# Altium schematic sheet power-v29.SchDoc: Power 29V
size Letter; CheckedBy: J. Brinton; CompanyName: Signal Laboratories, Inc.; DrawnBy: J. Brinton; Engineer: J. Brinton; Address1: 3479 Edison Way; Address2: Menlo Park CA 94025; Address3: +1 (877) 778-8435; Address4: siglabs.com; Revision: 3; SheetNumber: 41; SheetTotal: 53
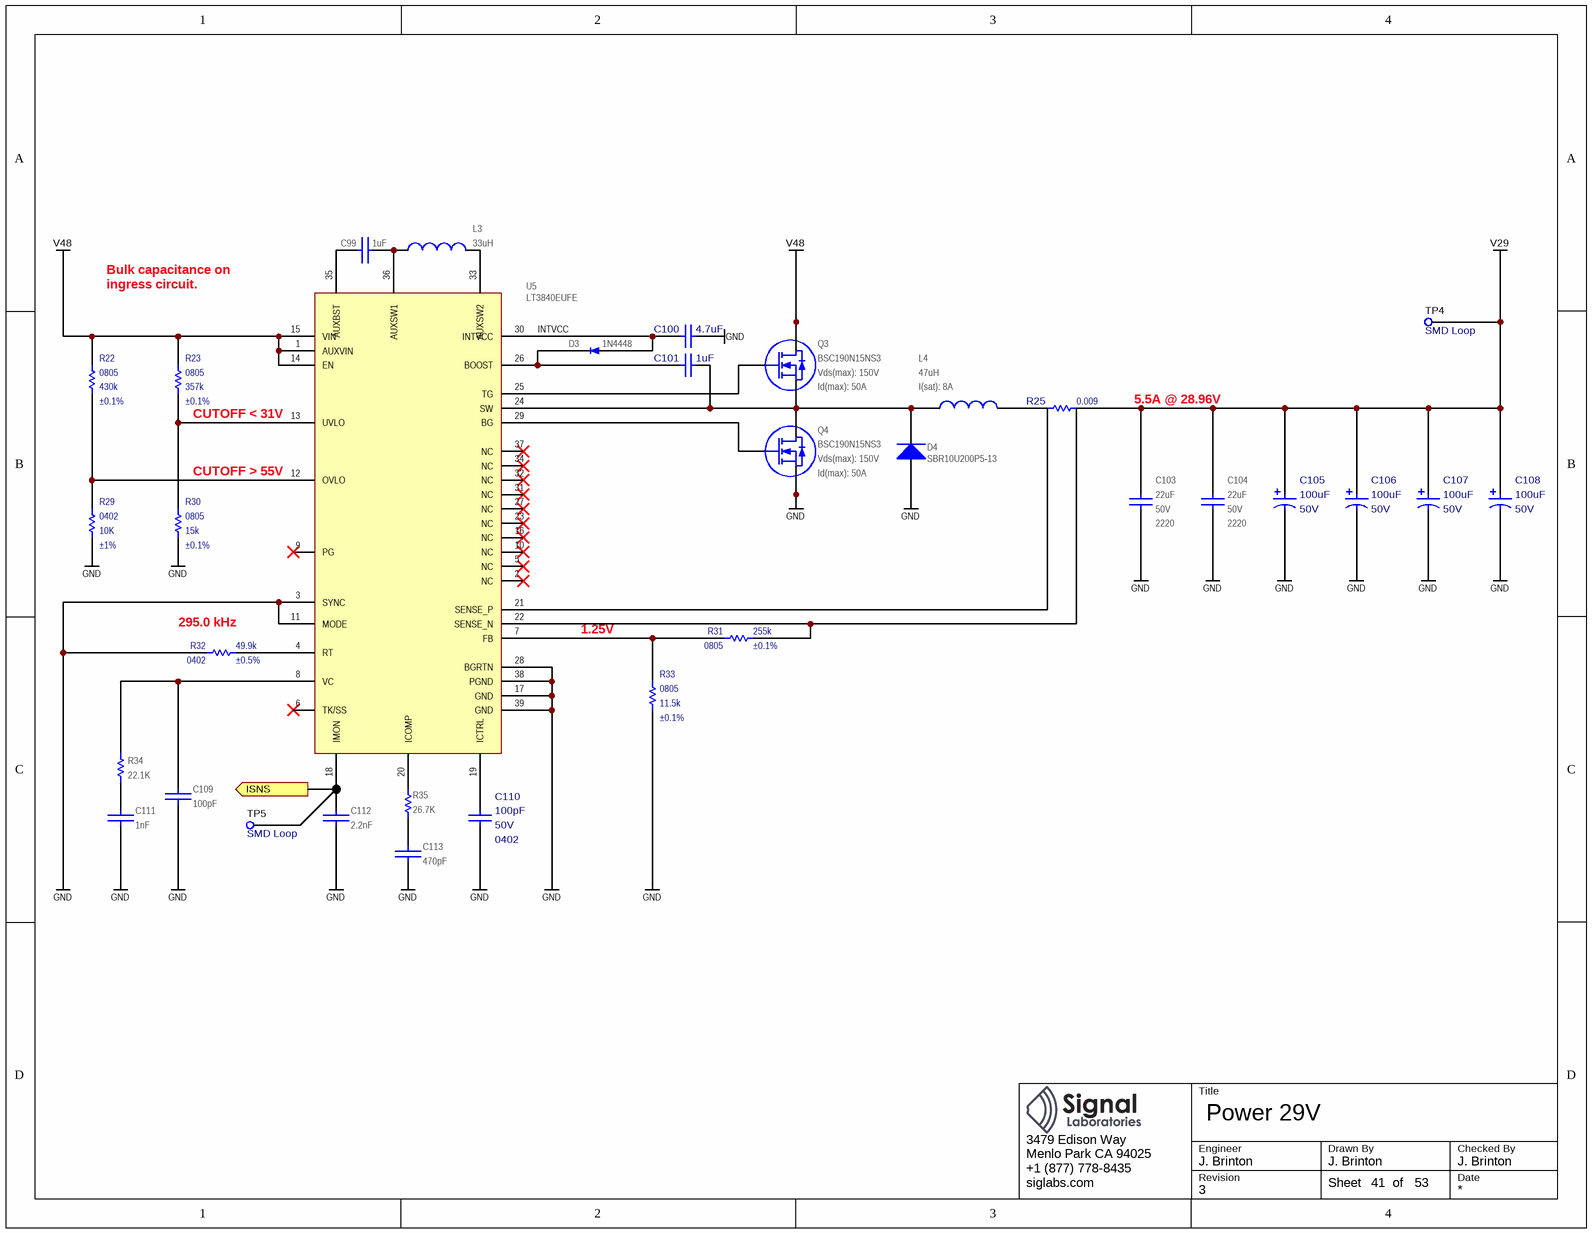
[diagram p0: power-v29.SchDoc]

## Parts
C99  value 1uF  [CAPC100X50X55L25N]  (hidden comment: GRM155R61A105KE15)
C100  value 4.7uF  [CAPC160X80X90L20N]  (hidden comment: CL10A475KA8NQNC)
C101  value 1uF  [CAPC100X50X55L25N]  (hidden comment: GRM155R61A105KE15)
C103  value 22uF  Voltage: 50V  Package: 2220  [CAPC600X500X500L160N]  (hidden comment: CKG57NX7S1H226M500JJ)
C104  value 22uF  Voltage: 50V  Package: 2220  [CAPC600X500X500L160N]  (hidden comment: CKG57NX7S1H226M500JJ)
C105  value 100uF  Voltage: 50V  [CAPAE660X800D700L260X65N]  (hidden comment: EEE-FTH101XAP)
C106  value 100uF  Voltage: 50V  [CAPAE660X800D700L260X65N]  (hidden comment: EEE-FTH101XAP)
C107  value 100uF  Voltage: 50V  [CAPAE660X800D700L260X65N]  (hidden comment: EEE-FTH101XAP)
C108  value 100uF  Voltage: 50V  [CAPAE660X800D700L260X65N]  (hidden comment: EEE-FTH101XAP)
C109  value 100pF  [CAPC100X50X55L25N]  (hidden comment: GRM1555C1H101JA01)
C110  value 100pF  Package: 0402  Voltage: 50V  [CAPC100X50X55L25N]  (hidden comment: VJ0402A101KXA)
C111  value 1nF  [CAPC100X50X55L25N]  (hidden comment: GRM1555C1H102JA01)
C112  value 2.2nF  [CAPC100X50X55L25N]  (hidden comment: C0402C222J3GACTU)
C113  value 470pF  [CAPC100X50X55L25N]  (hidden comment: GRM155R71H471JA01)
D3  Alternative P/N: 1N4448  [SOD323]  (hidden comment: 1N4448HWS-7-F)
D4  SBR10U200P5-13  [DIODES_POWERDI5]
L3  value 33uH  [ME3220]  (hidden comment: ME3220-333KL)
L4  value 47uH  I(sat): 8A  [HCM1A1707]  (hidden comment: HCM1A1707-470-R)
Q3  BSC190N15NS3  Vds(max): 150V  Id(max): 50A  [TDSON-8]
Q4  BSC190N15NS3  Vds(max): 150V  Id(max): 50A  [TDSON-8]
R22  value 430k  Tolerance: ±0.1%  Package: 0805  [RESC2012X70N]  (hidden comment: RT0805BRD07430KL)
R23  value 357k  Tolerance: ±0.1%  Package: 0805  [RESC2012X70N]  (hidden comment: RT0805BRD07357KL)
R25  value 0.009  [KRL3216T4]  (hidden comment: KRL3216T4A-M-R009-F)
R29  value 10K  Tolerance: ±1%  Package: 0402  [RESC2012X70N]  (hidden comment: ERJ-2RKF1002X)
R30  value 15k  Tolerance: ±0.1%  Package: 0805  [RESC2012X70N]  (hidden comment: RG2012P-153-B-T5)
R31  value 255k  Tolerance: ±0.1%  Package: 0805  [RESC2012X70N]  (hidden comment: PTN0805E2553BST1)
R32  value 49.9k  Tolerance: ±0.5%  Package: 0402  [RESC1005X40N]  (hidden comment: RR0510P-4992-D)
R33  value 11.5k  Tolerance: ±0.1%  Package: 0805  [RESC2012X70N]  (hidden comment: RT0805BRD0711K5L)
R34  value 22.1K  [RESC1005X40N]  (hidden comment: ERJ-2RKF2212X)
R35  value 26.7K  [RESC1005X40N]  (hidden comment: ERJ-2RKF2672X)
TP4  Notes: SMD Loop  [5015]  (hidden comment: 5015)
TP5  Notes: SMD Loop  [5015]  (hidden comment: 5015)
U5  LT3840EUFE  [QFN39P40_600X400X80L40X20T465X265N]

## Ports
ISNS (out)

## Nets
GND: C100.2 C103.1 C104.1 C105.2 C106.2 C107.2 C108.2 C109.1 C110.2 C111.2 C112.2 C113.1 D4.A Q4.1(S) Q4.2(S) Q4.3(S) R29.1 R30.1 R32.2 R33.1 U5.3(SYNC) U5.11(MODE) U5.17(GND) U5.28(BGRTN) U5.38(PGND) U5.39(GND)
V29: C103.2 C104.2 C105.1 C106.1 C107.1 C108.1 R25.1 TP4.1
V48: Q3.5(D) Q3.6(D) Q3.7(D) Q3.8(D) Q3.9(D) R22.2 R23.2 U5.1(AUXVIN) U5.14(EN) U5.15(VIN)
INTVCC: C100.1 D3.A U5.30(INTVCC)
ISNS: C112.1 TP5.1 U5.18(IMON) ; port ISNS
NetC99_1: C99.1 L3.1 U5.36(AUXSW1)
NetC99_2: C99.2 U5.35(AUXBST)
NetC101_1: C101.1 D3.K U5.26(BOOST)
NetC101_2: C101.2 D4.K L4.1 Q3.1(S) Q3.2(S) Q3.3(S) Q4.5(D) Q4.6(D) Q4.7(D) Q4.8(D) Q4.9(D) U5.24(SW)
NetC109_2: C109.2 R34.2 U5.8(VC)
NetC110_1: C110.1 U5.19(ICTRL)
NetC111_1: C111.1 R34.1
NetC113_2: C113.2 R35.2
NetL3_2: L3.2 U5.33(AUXSW2)
NetL4_2: L4.2 R25.2
NetQ3_4: Q3.4(G) U5.25(TG)
NetQ4_4: Q4.4(G) U5.29(BG)
NetR22_1: R22.1 R29.2 U5.12(OVLO)
NetR23_1: R23.1 R30.2 U5.13(UVLO)
NetR25_3: R25.3 R31.1 U5.22(SENSE_N)
NetR25_4: R25.4 U5.21(SENSE_P)
NetR31_2: R31.2 R33.2 U5.7(FB)
NetR32_1: R32.1 U5.4(RT)
NetR35_1: R35.1 U5.20(ICOMP)

Not connected (* = marked no-connect by the designer): U5 2(NC)* 5(NC)* 6(TK/SS)* 9(PG)* 10(NC)* 16(NC)* 23(NC)* 27(NC)* 31(NC)* 32(NC)* 34(NC)* 37(NC)*

## Notes on the sheet
- Bulk capacitance on
- ingress circuit.
- (near R23) CUTOFF < 31V
- 5.5A @ 28.96V
- CUTOFF > 55V
- (near R32) 295.0 kHz
- 1.25V
- Title
- Engineer
- Revision
- Drawn By
- Checked By
- Date
- Sheet
- of

## Library data of the parts
C99 = CAP: Ceramic Capacitor 1uF ±10% 10V X5R 0402; Manufacturer: Murata; Tr: -55:125; Manufacturer P/N: GRM155R61A105KE15; Package: 0402; Tolerance: ±10%; Voltage: 10V
C100 = TMK212B7475KG: Ceramic Capacitor 4.7uF ±10% 25V X5R 0603; Manufacturer: Samsung; Tr: -55:85; Manufacturer P/N: CL10A475KA8NQNC; Tolerance: ±10%; Package: 0603; Voltage: 25V
C101 = UMK212B7105KG: Ceramic Capacitor 1uF ±10% 10V X5R 0402; Manufacturer: Murata; Manufacturer P/N: GRM155R61A105KE15; Tolerance: ±10%; Tr: *; Package: 0402; Voltage: 10V
C103 C104 = CAP: Ceramic Capacitor 22uF ±20% 50V X7S Stacked; Manufacturer: TDK; Tr: -55:125; Manufacturer P/N: CKG57NX7S1H226M500JJ; Tolerance: ±20%
C105-C108 = CAP_POL: Aluminum Electrolytic Capacitor 100uF ±20% 50V; Manufacturer: Panasonic; Tr: -55:105; Manufacturer P/N: EEE-FTH101XAP; Tolerance: ±20%; Package: 6.3mm Radial
C109 = CAP: Ceramic Capacitor 100pF ±5% 50V NP0 0402; Manufacturer: Murata; Tr: -55:125; Manufacturer P/N: GRM1555C1H101JA01; Voltage: 50V; Package: 0402; Tolerance: ±5%
C110 = VJ0402A101KXA: Ceramic Capacitor 100pF ±10% 50V C0G 0402; Manufacturer: Vishay; Tr: -55:150; Manufacturer P/N: VJ0402A101KXA; Tolerance: ±10%
C111 = CAP: Ceramic Capacitor 1nF ±5% 50V NP0 0402; Manufacturer: Murata; Tr: -55:125; Manufacturer P/N: GRM1555C1H102JA01; Voltage: 50V; Package: 0402; Tolerance: ±5%
C112 = CAP: Ceramic Capacitor 2.2nF ±5% 25V NP0 0402; Manufacturer: Kemet; Tr: -55:125; Manufacturer P/N: C0402C222J3GACTU; Package: 0402; Tolerance: ±5%; Voltage: 25V
C113 = CAP: Ceramic Capacitor 470pF ±5% 50V X7R 0402; Manufacturer: Murata; Tr: -55:125; Manufacturer P/N: GRM155R71H471JA01; Voltage: 50V; Package: 0402; Tolerance: ±5%
D3 = 1N4448HWS-7-F: Schottky Diode 80V 250mA SOD323; Manufacturer: Diodes Inc; Manufacturer P/N: 1N4448HWS-7-F; Package: SOD323
D4 = PDS5100H: Schottky Diode 200V 10A SMD; Manufacturer: Diodes Inc; Manufacturer P/N: SBR10U200P5-13; Current: 10A; Reverse Voltage (max): 200V; Package: PowerDi-5
L3 = COIL: Inductor 33uH ±10% 500mA SMD; Manufacturer: Coilcraft; Tr: -40:85; Manufacturer P/N: ME3220-333KL; I(sat): 500mA; Package: *; Tolerance: ±10%
L4 = COIL: Inductor 47uH, 8A(sat), SMD; Manufacturer: Eaton; Manufacturer P/N: HCM1A1707-470-R
Q3 Q4 = BSC190N15NS3: MOSFET N-Channel Enhancement Mode; Manufacturer: Infineon; Rds(on): 19mOhm; Manufacturer P/N: BSC190N15NS3
R22 = RES: Thin Film Resistor 430k +/-0.1% SMD 0805; Manufacturer: Yageo; Tr: -55:155; Tcr: *; Manufacturer P/N: RT0805BRD07430KL; Alternatives: *; Voltage: *; Power: *
R23 = RES: Thin Film Resistor 357k +/-0.1% SMD 0805; Manufacturer: Yageo; Tr: -55:155; Tcr: *; Manufacturer P/N: RT0805BRD07357KL; Alternatives: *; Voltage: *; Power: *
R25 = KRL3216T4A-M-R009-F: Current Sense Resistor 9 mOhms +/-1% SMD 4-Terminal; Manufacturer: Susumu; Tolerance: ±1%; Tr: -55:+155; Manufacturer P/N: KRL3216T4A-M-R009-F
R29 = RES: Thick Film Resistor 10k ±1% 0.1W 50V 0402; Manufacturer: Panasonic; Tr: -55:155; Tcr: *; Manufacturer P/N: ERJ-2RKF1002X; Alternatives: *; Voltage: *; Power: *
R30 = RES: Thin Film Resistor 15k +/-0.1% SMD 0805; Manufacturer: Susumu; Tr: -55:155; Tcr: *; Manufacturer P/N: RG2012P-153-B-T5; Alternatives: *; Voltage: *; Power: *
R31 = RES: Thin Film Resistor 255k +/-0.1% SMD 0805; Manufacturer: Vishay; Tr: -55:155; Tcr: *; Manufacturer P/N: PTN0805E2553BST1; Alternatives: *; Voltage: *; Power: *
R32 = RES: Thin Film Resistor 49.9k +/-0.5% SMD 0402; Manufacturer: Susumu; Tr: -55:155; Tcr: *; Manufacturer P/N: RR0510P-4992-D; Alternatives: *; Voltage: *; Power: *
R33 = RES: Thin Film Resistor 11.5k +/-0.1% SMD 0805; Manufacturer: Yageo; Tr: -55:155; Tcr: *; Manufacturer P/N: RT0805BRD0711K5L; Alternatives: *; Voltage: *; Power: *
R34 = RES 0402: Thick Film Resistor 22.1k ±1% 0402; Manufacturer: Panasonic; Tr: -55:155; Package: 0402; Manufacturer P/N: ERJ-2RKF2212X; Tolerance: ±1%
R35 = RES 0402: Thick Film Resistor 26.7k ±1% 0402; Manufacturer: Panasonic; Tr: -55:155; Package: 0402; Manufacturer P/N: ERJ-2RKF2672X; Tolerance: ±1%
TP4 TP5 = TEST_POINT_SMD_50: Test Point SMD; Manufacturer: Keystone; Manufacturer P/N: 5015
U5 = LT3840EUFE: Synchronous Regulator Controller; Manufacturer: Linear Technology; Alternative P/N: LT3840IUFE; Manufacturer P/N: LT3840EUFE